# Altium schematic sheet RTDsSheet1.SchDoc
size A4
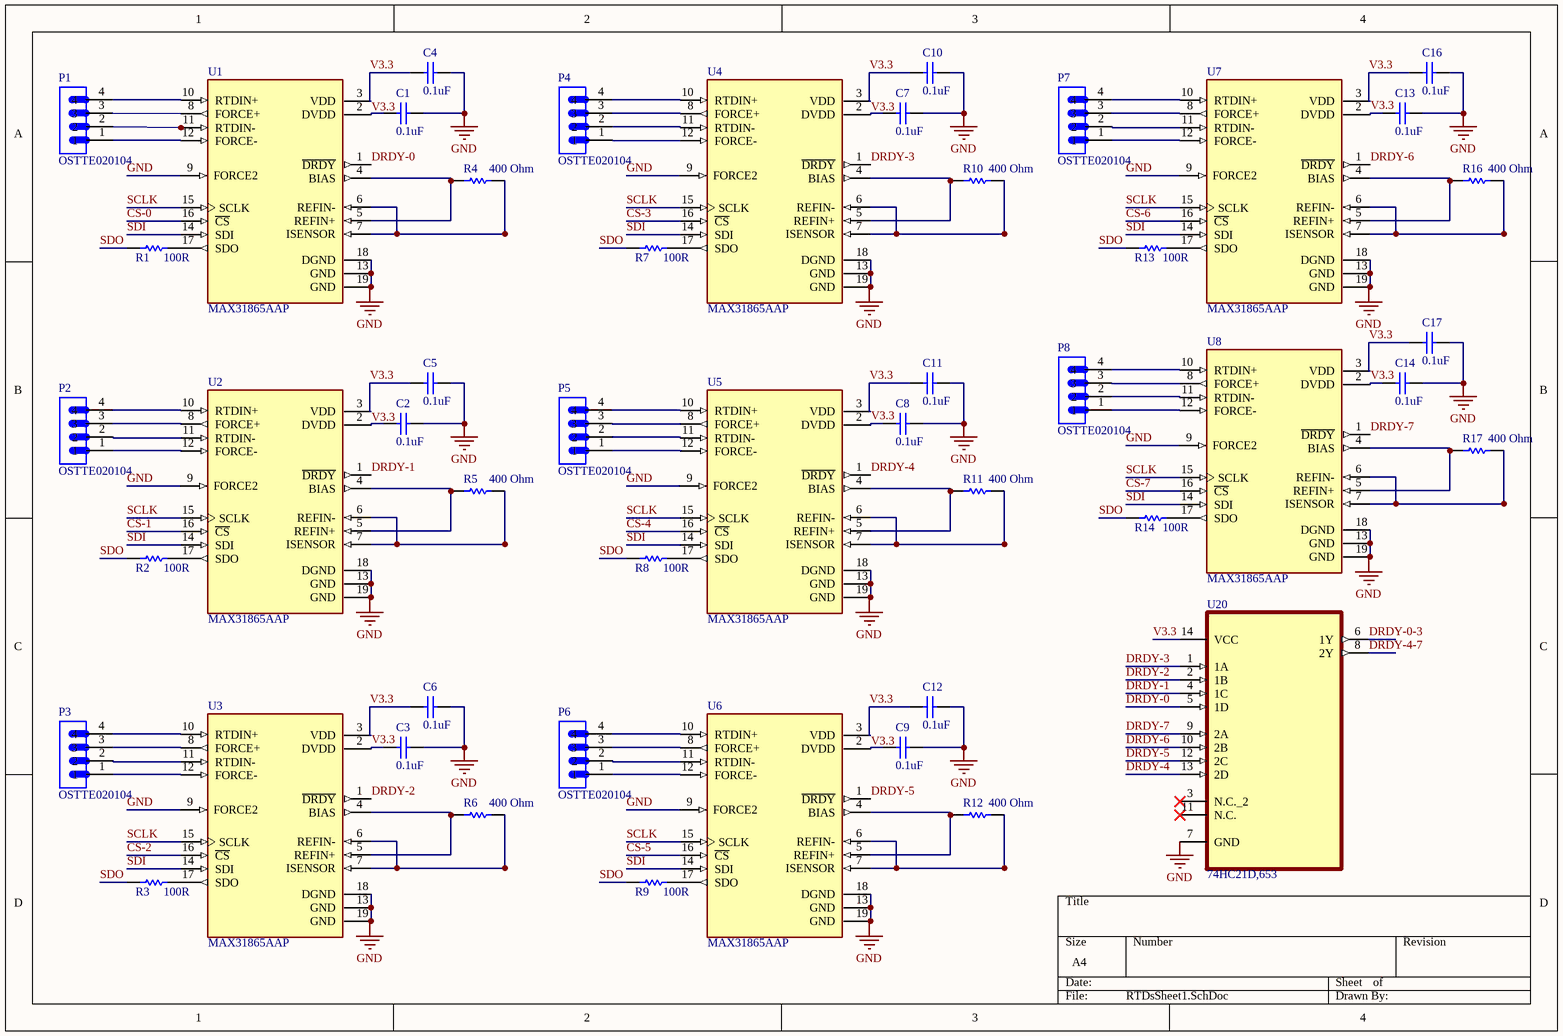
[diagram p0: RTDsSheet1.SchDoc]

## Parts
C1  value 0.1uF  [1608[0603]]
C2  value 0.1uF  [1608[0603]]
C3  value 0.1uF  [1608[0603]]
C4  value 0.1uF  [1608[0603]]
C5  value 0.1uF  [1608[0603]]
C6  value 0.1uF  [1608[0603]]
C7  value 0.1uF  [1608[0603]]
C8  value 0.1uF  [1608[0603]]
C9  value 0.1uF  [1608[0603]]
C10  value 0.1uF  [1608[0603]]
C11  value 0.1uF  [1608[0603]]
C12  value 0.1uF  [1608[0603]]
C13  value 0.1uF  [1608[0603]]
C14  value 0.1uF  [1608[0603]]
C16  value 0.1uF  [1608[0603]]
C17  value 0.1uF  [1608[0603]]
P1  OSTTE020104  [TE_3-641209-4]
P2  OSTTE020104  [TE_3-641209-4]
P3  OSTTE020104  [TE_3-641209-4]
P4  OSTTE020104  [TE_3-641209-4]
P5  OSTTE020104  [TE_3-641209-4]
P6  OSTTE020104  [TE_3-641209-4]
P7  OSTTE020104  [TE_3-641209-4]
P8  OSTTE020104  [TE_3-641209-4]
R1  value 100R  [1608[0603]]
R2  value 100R  [1608[0603]]
R3  value 100R  [1608[0603]]
R4  value 400 Ohm  [6-0805_M]
R5  value 400 Ohm  [6-0805_M]
R6  value 400 Ohm  [6-0805_M]
R7  value 100R  [1608[0603]]
R8  value 100R  [1608[0603]]
R9  value 100R  [1608[0603]]
R10  value 400 Ohm  [6-0805_M]
R11  value 400 Ohm  [6-0805_M]
R12  value 400 Ohm  [6-0805_M]
R13  value 100R  [1608[0603]]
R14  value 100R  [1608[0603]]
R16  value 400 Ohm  [6-0805_M]
R17  value 400 Ohm  [6-0805_M]
U1  MAX31865AAP  [SOP65P777X199-20N]
U2  MAX31865AAP  [SOP65P777X199-20N]
U3  MAX31865AAP  [SOP65P777X199-20N]
U4  MAX31865AAP  [SOP65P777X199-20N]
U5  MAX31865AAP  [SOP65P777X199-20N]
U6  MAX31865AAP  [SOP65P777X199-20N]
U7  MAX31865AAP  [SOP65P777X199-20N]
U8  MAX31865AAP  [SOP65P777X199-20N]
U20  74HC21D,653  [SOIC127P600X175-14N]

## Nets
GND: C1.1 C2.1 C3.1 C4.1 C5.1 C6.1 C7.1 C8.1 C9.1 C10.1 C11.1 C12.1 C13.1 C14.1 C16.1 C17.1 U1.9(FORCE2) U1.13(GND) U1.18(DGND) U1.19(GND) U2.9(FORCE2) U2.13(GND) U2.18(DGND) U2.19(GND) U3.9(FORCE2) U3.13(GND) U3.18(DGND) U3.19(GND) U4.9(FORCE2) U4.13(GND) U4.18(DGND) U4.19(GND) U5.9(FORCE2) U5.13(GND) U5.18(DGND) U5.19(GND) U6.9(FORCE2) U6.13(GND) U6.18(DGND) U6.19(GND) U7.9(FORCE2) U7.13(GND) U7.18(DGND) U7.19(GND) U8.9(FORCE2) U8.13(GND) U8.18(DGND) U8.19(GND) U20.7(GND)
CS-0: U1.16(~{CS})
CS-1: U2.16(~{CS})
CS-2: U3.16(~{CS})
CS-3: U4.16(~{CS})
CS-4: U5.16(~{CS})
CS-5: U6.16(~{CS})
CS-6: U7.16(~{CS})
CS-7: U8.16(~{CS})
DRDY-0: U1.1(~{DRDY}) U20.5(1D)
DRDY-0-3: U20.6(1Y)
DRDY-1: U2.1(~{DRDY}) U20.4(1C)
DRDY-2: U3.1(~{DRDY}) U20.2(1B)
DRDY-3: U4.1(~{DRDY}) U20.1(1A)
DRDY-4: U5.1(~{DRDY}) U20.13(2D)
DRDY-4-7: U20.8(2Y)
DRDY-5: U6.1(~{DRDY}) U20.12(2C)
DRDY-6: U7.1(~{DRDY}) U20.10(2B)
DRDY-7: U8.1(~{DRDY}) U20.9(2A)
SCLK: U1.15(SCLK) U2.15(SCLK) U3.15(SCLK) U4.15(SCLK) U5.15(SCLK) U6.15(SCLK) U7.15(SCLK) U8.15(SCLK)
SDI: U1.14(SDI) U2.14(SDI) U3.14(SDI) U4.14(SDI) U5.14(SDI) U6.14(SDI) U7.14(SDI) U8.14(SDI)
SDO: R1.2 R2.2 R3.2 R7.2 R8.2 R9.2 R13.2 R14.2
V3.3: C1.2 C2.2 C3.2 C4.2 C5.2 C6.2 C7.2 C8.2 C9.2 C10.2 C11.2 C12.2 C13.2 C14.2 C16.2 C17.2 U1.2(DVDD) U1.3(VDD) U2.2(DVDD) U2.3(VDD) U3.2(DVDD) U3.3(VDD) U4.2(DVDD) U4.3(VDD) U5.2(DVDD) U5.3(VDD) U6.2(DVDD) U6.3(VDD) U7.2(DVDD) U7.3(VDD) U8.2(DVDD) U8.3(VDD) U20.14(VCC)
NetP1_1: P1.1 U1.12(FORCE-)
NetP1_2: P1.2 U1.11(RTDIN-)
NetP1_3: P1.3 U1.8(FORCE+)
NetP1_4: P1.4 U1.10(RTDIN+)
NetP2_1: P2.1 U2.12(FORCE-)
NetP2_2: P2.2 U2.11(RTDIN-)
NetP2_3: P2.3 U2.8(FORCE+)
NetP2_4: P2.4 U2.10(RTDIN+)
NetP3_1: P3.1 U3.12(FORCE-)
NetP3_2: P3.2 U3.11(RTDIN-)
NetP3_3: P3.3 U3.8(FORCE+)
NetP3_4: P3.4 U3.10(RTDIN+)
NetP4_1: P4.1 U4.12(FORCE-)
NetP4_2: P4.2 U4.11(RTDIN-)
NetP4_3: P4.3 U4.8(FORCE+)
NetP4_4: P4.4 U4.10(RTDIN+)
NetP5_1: P5.1 U5.12(FORCE-)
NetP5_2: P5.2 U5.11(RTDIN-)
NetP5_3: P5.3 U5.8(FORCE+)
NetP5_4: P5.4 U5.10(RTDIN+)
NetP6_1: P6.1 U6.12(FORCE-)
NetP6_2: P6.2 U6.11(RTDIN-)
NetP6_3: P6.3 U6.8(FORCE+)
NetP6_4: P6.4 U6.10(RTDIN+)
NetP7_1: P7.1 U7.12(FORCE-)
NetP7_2: P7.2 U7.11(RTDIN-)
NetP7_3: P7.3 U7.8(FORCE+)
NetP7_4: P7.4 U7.10(RTDIN+)
NetP8_1: P8.1 U8.12(FORCE-)
NetP8_2: P8.2 U8.11(RTDIN-)
NetP8_3: P8.3 U8.8(FORCE+)
NetP8_4: P8.4 U8.10(RTDIN+)
NetR1_1: R1.1 U1.17(SDO)
NetR2_1: R2.1 U2.17(SDO)
NetR3_1: R3.1 U3.17(SDO)
NetR4_1: R4.1 U1.6(REFIN-) U1.7(ISENSOR)
NetR4_2: R4.2 U1.4(BIAS) U1.5(REFIN+)
NetR5_1: R5.1 U2.6(REFIN-) U2.7(ISENSOR)
NetR5_2: R5.2 U2.4(BIAS) U2.5(REFIN+)
NetR6_1: R6.1 U3.6(REFIN-) U3.7(ISENSOR)
NetR6_2: R6.2 U3.4(BIAS) U3.5(REFIN+)
NetR7_1: R7.1 U4.17(SDO)
NetR8_1: R8.1 U5.17(SDO)
NetR9_1: R9.1 U6.17(SDO)
NetR10_1: R10.1 U4.6(REFIN-) U4.7(ISENSOR)
NetR10_2: R10.2 U4.4(BIAS) U4.5(REFIN+)
NetR11_1: R11.1 U5.6(REFIN-) U5.7(ISENSOR)
NetR11_2: R11.2 U5.4(BIAS) U5.5(REFIN+)
NetR12_1: R12.1 U6.6(REFIN-) U6.7(ISENSOR)
NetR12_2: R12.2 U6.4(BIAS) U6.5(REFIN+)
NetR13_1: R13.1 U7.17(SDO)
NetR14_1: R14.1 U8.17(SDO)
NetR16_1: R16.1 U7.6(REFIN-) U7.7(ISENSOR)
NetR16_2: R16.2 U7.4(BIAS) U7.5(REFIN+)
NetR17_1: R17.1 U8.6(REFIN-) U8.7(ISENSOR)
NetR17_2: R17.2 U8.4(BIAS) U8.5(REFIN+)

Not connected (* = marked no-connect by the designer): U20 3(N.C._2)* 11(N.C.)*

## Library data of the parts
C1-C14 C16 C17 = Cap Semi: Capacitor (Semiconductor SIM Model); Published: 8-Jun-2000; LatestRevisionDate: 29-May-2009; LatestRevisionNote: IPC-7351 Footprint Added.; PackageReference: C1206; Publisher: Altium Limited; PackageDescription: Chip Capacitor
P1-P8 = OSTTE020104: Terminal Block 3.5mm 2pos Pcb; MF: {'manufacturer': u'On Shore'}; Availability: Unavailable; Package: None; MP: OSTTE020104; Value: *; Price: None
R1-R14 R16 R17 = Res Semi: Semiconductor Resistor; Published: 8-Jun-2000; LatestRevisionDate: 17-Jul-2002; LatestRevisionNote: Re-released for DXP Platform.; PackageReference: AXIAL-0.5; Publisher: Altium Limited; PackageDescription: Axial Device, Thru-Hole; 2 Leads; 0.5 in Pin Spacing
U1-U8 = MAX31865AAP: Rtd To Digital Converter In Ssop Tr; MF: {'manufacturer': u'Maxim Integrated'}; Availability: Unavailable; Package: None; MP: MAX31865AAP; Value: *; Price: None
U20 = 74HC21D,653: Dual 4-input AND gate; MF: {'manufacturer': u'Nexperia USA'}; Value: *; Availability: Unavailable; Price: None; Package: None; MP: 74HC21D,653